# Altium schematic sheet Adquisición_SeñalEMG1.SchDoc
size A4; SheetNumber: 1; SheetTotal: 1; SPICEModelCacheWQRGLCHU: <root> / <DocumentId>WQRGLCHU</DocumentId> / <CacheFrame Number="0"> / <Model Name="mcp601" Kind="CKT"> / <Text>.SUBCKT MCP601 1 2 3 4 5 / *              | | | | | / *              | | | | Output / *              | | | Negative Supply / *              | | Positive Supply / *              | Inverting Input / *              Non-inverting Input / * / ******************************************************************************** / * Software License Agreement                                                   * / *                                                                              * / * The software supplied herewith by Microchip Technology Incorporated (the     * / * 'Company') is intended and supplied to you, the Company's customer, for use  * / * soley and exclusively on Microchip products.                                 * / *                                                                              * / * The software is owned by the Company and/or its supplier, and is protected   * / * under applicable copyright laws. All rights are reserved. Any use in         * / * violation of the foregoing restrictions may subject the user to criminal     * / * sanctions under applicable laws, as well as to civil liability for the       * / * breach of the terms and conditions of this license.                          * / *                                                                              * / * THIS SOFTWARE IS PROVIDED IN AN 'AS IS' CONDITION. NO WARRANTIES, WHETHER    * / * EXPRESS, IMPLIED OR STATUTORY, INCLUDING, BUT NOT LIMITED TO, IMPLIED        * / * WARRANTIES OF MERCHANTABILITY AND FITNESS FOR A PARTICULAR PURPOSE APPLY TO  * / * THIS SOFTWARE. THE COMPANY SHALL NOT, IN ANY CIRCUMSTANCES, BE LIABLE FOR    * / * SPECIAL, INCIDENTAL OR CONSEQUENTIAL DAMAGES, FOR ANY REASON WHATSOEVER.     * / ******************************************************************************** / * / * The following op-amps are covered by this model: / *      MCP601,MCP602,MCP603,MCP604 / * / * Revision History: / *   REV A: 30-Jun-99, BCB (created model) / *   REV B: 10-Jul-99, BCB (corrected DC Iq) / *   REV C: 30-Nov-99, BCB (".subckt" on first line, moved L, W to model) / *   REV D: 17-Jul-02, KEB (improved model) / *   REV E: 27-Aug-06, HNV (added over temperature, improved output stage, / *                         fixed overdrive recovery time) / *                         (MC_RQ, 27-Aug-06, Level 1.17) / * / * Recommendations: / *      Use PSPICE (other simulators may require translation) / *      For a quick, effective design, use a combination of: data sheet / *            specs, bench testing, and simulations with this macromodel / *      For high impedance circuits, set GMIN=100F in the .OPTIONS statement / * / * Supported: / *      Typical performance for temperature range (-40 to 125) degrees Celsius / *      DC, AC, Transient, and Noise analyses. / *      Most specs, including: offsets, DC PSRR, DC CMRR, input impedance, / *            open loop gain, voltage ranges, supply current, ... , etc. / *      Temperature effects for Ibias, Iquiescent, Iout short circuit / *            current, Vsat on both rails, Slew Rate vs. Temp and P.S. / * / * Not Supported: / *      Chip select (MCP603) / *      Some Variation in specs vs. Power Supply Voltage / *      Monte Carlo (Vos, Ib),Process variation / *      Distortion (detailed non-linear behavior) / *      Behavior outside normal operating region / * / * Input Stage / V10  3 10 1.00 / R10 10 11 771K / R11 10 12 771K / G10 10 11 10 11 129U / G11 10 12 10 12 129U / C11 11 12 2P / C12  1  0 6P / E12 71 14 POLY(4) 20 0 21 0 26 0 27 0 1.00M 15 15 1 1 / G12 1 0 62 0 1m / M12 11 14 15 15 NMI / G13 1 2 62 0 .015m / M14 12 2 15 15 NMI / G14 2 0 62 0 1m / C14  2  0 6P / I15 15 4 40.0U / V16 16 4 -300M / GD16 16 1 TABLE {V(16,1)} ((-100,-1p)(0,0)(1m,1u)(2m,10m)) / V13 3 13 1.2 / GD13 2 13 TABLE {V(2,13)} ((-100,-1p)(0,0)(1m,1u)(2m,10m)) / R71  1  0 20.0E12 / R72  2  0 20.0E12 / R73  1  2 20.0E12 / I80  1  2 400F / * / * Noise, PSRR, and CMRR / I20 21 20 423U / D20 20  0 DN1 / D21  0 21 DN1 / G26  0 26 POLY(2) 3 0 4 0   0.00 -50.1U -63.0U / R26 26  0 1 / E271 275 0 1 0 1 / E272 276 0 2 0 1 / R271 275 271 12k / R272 276 272 12k / R273 271 0 1k / R274 272 0 1k / C271 275 271 8.5p / C272 276 272 8.5p / G27  0 27 POLY(2) 271 0 272 0  -555U 100U 100U / R27 27  0 1 / * / * Open Loop Gain, Slew Rate / G30  0 30 12 11 1 / R30 30  0 1.00K / I31 0 31 DC 109.7 / R31 31  0 1 TC=-3.87M,-2.12U / GD31 30 0 TABLE {V(30,31)} ((-100,-1n)(0,0)(1m,0.1)(2m,2)) / I32 32 0 DC 120 / R32 32  0 1 TC=-3.71M,-4.74U / GD32 0 30 TABLE {V(30,32)} ((-2m,2)(-1m,0.1)(0,0)(100,-1n)) / G33  0 33 30 0 1m / R33  33 0 1K / G34  0 34 33 0 334M / R34  34 0 1K / C34  34 0 17.4U / G37  0 37 34 0 1m / R37  37 0 1K / C37  37 0 27P / G38  0 38 37 0 1m / R38  39 0 1K / L38  38 39 44U / E38  35 0 38 0 1 / G35 33 0 TABLE {V(35,3)} ((-1,-1n)(0,0)(5,1n))(6,1)) / G36 33 0 TABLE {V(35,4)} ((-5,-1)((-4,-1n)(0,0)(1,1n)) / * / * Output Stage / R80 50 0 100MEG / G50 0 50 57 96 2 / R58 57  96 0.50 / R57 57  0 500 / C58  5  0 2.00P / G57  0 57 POLY(3) 3 0 4 0 35 0   0 0.2M 0.22M 2.00M / GD55 55 57 TABLE {V(55,57)} ((-2m,-1)(-1m,-1m)(0,0)(10,1n)) / GD56 57 56 TABLE {V(57,56)} ((-2m,-1)(-1m,-1m)(0,0)(10,1n)) / E55 55  0 POLY(2) 3 0 51 0 -2.4M 1 -58.8M / E56 56  0 POLY(2) 4 0 52 0 1.7M 1 -32.3M / R51 51 0 1k / R52 52 0 1k / GD51 50 51 TABLE {V(50,51)} ((-10,-1n)(0,0)(1m,1m)(2m,1)) / GD52 50 52 TABLE {V(50,52)}  ((-2m,-1)(-1m,-1m)(0,0)(10,1n)) / G53  3  0 POLY(1) 51 0  -40.0U 1M / G54  0  4 POLY(1) 52 0  -40.0U -1M / * / * Current Limit / G99 96 5 99 0 1 / R98 0 98 1 TC=-4.33M,9.53U / G97 0 98 TABLE { V(96,5) } ((-11.0,-15.0M)(-1.00M,-14.8M)(0,0)(1.00M,14.8M)(11.0,15.0M)) / E97 99 0 VALUE { V(98)*((V(3)-V(4))*233M + 183M)} / D98 4 5 DESD / D99 5 3 DESD / * / * Temperature / Voltage Sensitive IQuiscent / R61 0 61 1 TC=-3.20M,-8.90U / G61 3 4 61 0 1 / G60 0 61 TABLE {V(3, 4)} / + ((0,0)(900M,0.1U)(1.1,10.0U)(1.3,40.0U) / + (1.6,60.0U)(2.5,200U)(5.5,220U)) / * / * Temperature Sensistive offset voltage / I73 0 70 DC 1uA / R74 0 70 1 TC=2.5 / E75 1 71 70 0 1 / * / * Temp Sensistive IBias / I62 0 62 DC 1uA / R62 0 62 REXP 99U / * / * Models / .MODEL NMI NMOS(L=2.00U W=42.0U KP=20.0U LEVEL=1 ) / .MODEL DESD  D   N=1 IS=1.00E-15 / .MODEL DN1 D   IS=1P KF=0.35F AF=1 / .MODEL REXP RES TCE= 9.1 / .ENDS MCP601</Text> / </Model> / </CacheFrame> / </root>
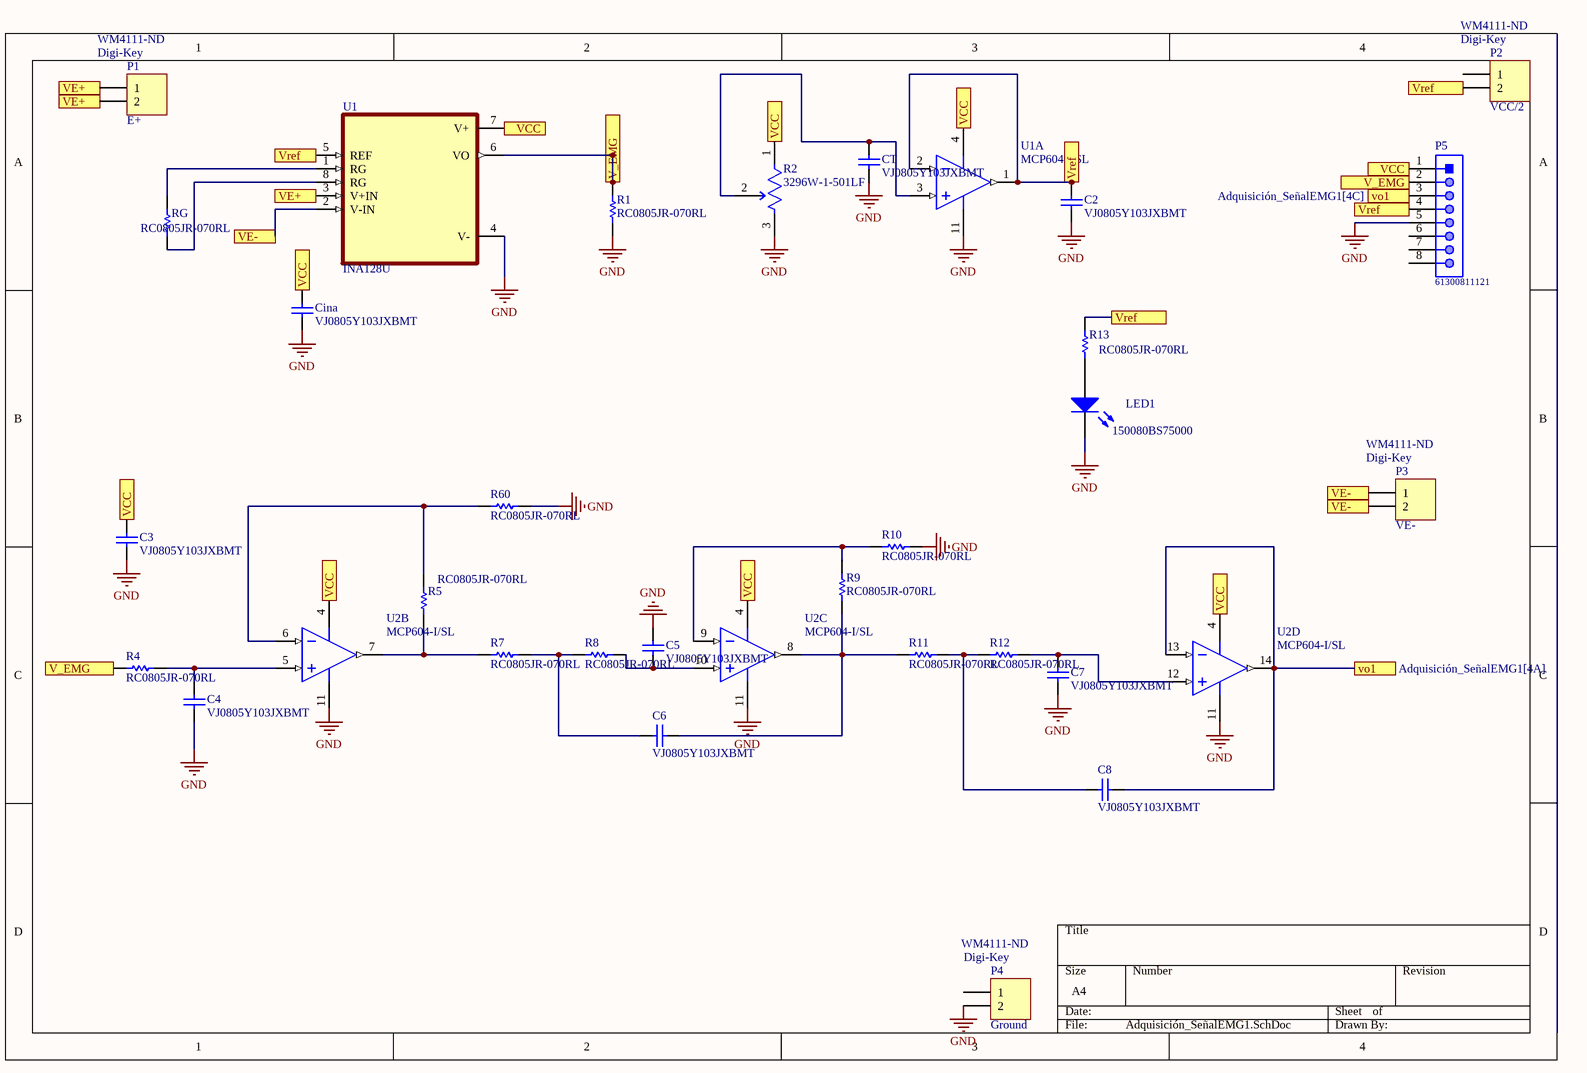
[diagram p0: Adquisición_SeñalEMG1.SchDoc]

## Parts
(Parts that share a designator on the sheet are numbered #1, #2 ... from top to bottom, then left to right.)
C2  VJ0805Y103JXBMT  [CAPC2013X145X48LL20T23]
C3  VJ0805Y103JXBMT  [CAPC2013X145X48LL20T23]
C4  VJ0805Y103JXBMT  [CAPC2013X145X48LL20T23]
C5  VJ0805Y103JXBMT  [CAPC2013X145X48LL20T23]
C6  VJ0805Y103JXBMT  [CAPC2013X145X48LL20T23]
C7  VJ0805Y103JXBMT  [CAPC2013X145X48LL20T23]
C8  VJ0805Y103JXBMT  [CAPC2013X145X48LL20T23]
Cina  VJ0805Y103JXBMT  [CAPC2013X145X48LL20T23]
CT  VJ0805Y103JXBMT  [CAPC2013X145X48LL20T23]
LED1  150080BS75000  [0805_A]
P1  E+  Supplier 1: Digi-Key  Supplier Part Number 1: WM4111-ND  [HDR1X2]
P2  VCC/2  Supplier 1: Digi-Key  Supplier Part Number 1: WM4111-ND  [HDR1X2]
P3  VE-  Supplier 1: Digi-Key  Supplier Part Number 1: WM4111-ND  [HDR1X2]
P4  Ground  Supplier 1: Digi-Key  Supplier Part Number 1: WM4111-ND  [HDR1X2]
P5  61300811121  [61300811121]
R1  RC0805JR-070RL  [RESC2013X60X35ML10T20]
R2  3296W-1-501LF  [FP-3296W-MFG]
R4  RC0805JR-070RL  [RESC2013X60X35ML10T20]
R5  RC0805JR-070RL  [RESC2013X60X35ML10T20]
R7  RC0805JR-070RL  [RESC2013X60X35ML10T20]
R8  RC0805JR-070RL  [RESC2013X60X35ML10T20]
R9  RC0805JR-070RL  [RESC2013X60X35ML10T20]
R10  RC0805JR-070RL  [RESC2013X60X35ML10T20]
R11  RC0805JR-070RL  [RESC2013X60X35ML10T20]
R12  RC0805JR-070RL  [RESC2013X60X35ML10T20]
R13  RC0805JR-070RL  [RESC2013X60X35ML10T20]
R60  RC0805JR-070RL  [RESC2013X60X35ML10T20]
RG  RC0805JR-070RL  [RESC2013X60X35ML10T20]
U1#1  MCP604-I/SL  [SOIC-SL14_M]  (part A of 4)
U1#2  INA128U  [SOIC127P599X175-8N]
U2  MCP604-I/SL  [SOIC-SL14_M]  (parts B,C,D of 4)

## Ports
V_EMG (see Adquisición_SeñalEMG1[1C], Adquisición_SeñalEMG1[2A]), V_EMG (see Adquisición_SeñalEMG1[1C], Adquisición_SeñalEMG1[4A]), V_EMG (see Adquisición_SeñalEMG1[2A], Adquisición_SeñalEMG1[4A]), VCC (see Adquisición_SeñalEMG1[1B], Adquisición_SeñalEMG1[1C], Adquisición_SeñalEMG1[2A], Adquisición_SeñalEMG1[2C], Adquisición_SeñalEMG1[3A], Adquisición_SeñalEMG1[4A]), VCC (see Adquisición_SeñalEMG1[1B], Adquisición_SeñalEMG1[1C], Adquisición_SeñalEMG1[2A], Adquisición_SeñalEMG1[2C], Adquisición_SeñalEMG1[3A], Adquisición_SeñalEMG1[4A], Adquisición_SeñalEMG1[4C]), VCC (see Adquisición_SeñalEMG1[1B], Adquisición_SeñalEMG1[1C], Adquisición_SeñalEMG1[2A], Adquisición_SeñalEMG1[2C], Adquisición_SeñalEMG1[3A], Adquisición_SeñalEMG1[4C]), VCC (see Adquisición_SeñalEMG1[1B], Adquisición_SeñalEMG1[1C], Adquisición_SeñalEMG1[2A], Adquisición_SeñalEMG1[2C], Adquisición_SeñalEMG1[4A], Adquisición_SeñalEMG1[4C]), VCC (see Adquisición_SeñalEMG1[1B], Adquisición_SeñalEMG1[1C], Adquisición_SeñalEMG1[2A], Adquisición_SeñalEMG1[3A], Adquisición_SeñalEMG1[4A], Adquisición_SeñalEMG1[4C]), VCC (see Adquisición_SeñalEMG1[1B], Adquisición_SeñalEMG1[2A], Adquisición_SeñalEMG1[2C], Adquisición_SeñalEMG1[3A], Adquisición_SeñalEMG1[4A], Adquisición_SeñalEMG1[4C]), VE+ (see Adquisición_SeñalEMG1[1A]), VE- (see Adquisición_SeñalEMG1[1A], Adquisición_SeñalEMG1[4B]), VE- (see Adquisición_SeñalEMG1[4B]), vo1 (see Adquisición_SeñalEMG1[4A]), vo1 (see Adquisición_SeñalEMG1[4C]), Vref (see Adquisición_SeñalEMG1[1A], Adquisición_SeñalEMG1[3A], Adquisición_SeñalEMG1[3B], Adquisición_SeñalEMG1[4A]), Vref (see Adquisición_SeñalEMG1[1A], Adquisición_SeñalEMG1[3A], Adquisición_SeñalEMG1[4A]), Vref (see Adquisición_SeñalEMG1[1A], Adquisición_SeñalEMG1[3B], Adquisición_SeñalEMG1[4A]), Vref (see Adquisición_SeñalEMG1[3A], Adquisición_SeñalEMG1[3B], Adquisición_SeñalEMG1[4A])

## Nets
GND: C2.1 C3.1 C4.1 C5.1 C7.2 Cina.1 CT.1 LED1.1(K) P4.2 P5.5 R1.1 R2.3(CW) R10.2 R60.1 U1#1.11(VSS) U1#2.4(V-) U2.11(VSS)
V_EMG: P5.2 R1.2 R4.1 U1#2.6(VO) ; port V_EMG
VCC: C3.2 Cina.2 P5.1 R2.1(CCW) U1#1.4(VDD) U1#2.7(V+) U2.4(VDD) ; port VCC
VE+: P1.1 P1.2 U1#2.3(V+IN) ; port VE+
VE-: P3.1 P3.2 U1#2.2(V-IN) ; port VE-
vo1: C8.2 P5.3 U2.13(VIND-) U2.14(VOUTD) ; port vo1
Vref: C2.2 P2.2 P5.4 R13.2 U1#1.1(VOUTA) U1#1.2(VINA-) U1#2.5(REF) ; port Vref
NetC4_2: C4.2 R4.2 U2.5(VINB+)
NetC5_2: C5.2 R8.2 U2.10(VINC+)
NetC6_1: C6.1 R9.1 R11.1 U2.8(VOUTC)
NetC6_2: C6.2 R7.2 R8.1
NetC7_1: C7.1 R12.2 U2.12(VIND+)
NetC8_1: C8.1 R11.2 R12.1
NetCT_2: CT.2 R2.2(WIPER) U1#1.3(VINA+)
NetLED1_2: LED1.2(A) R13.1
NetR5_1: R5.1 R7.1 U2.7(VOUTB)
NetR5_2: R5.2 R60.2 U2.6(VINB-)
NetR9_2: R9.2 R10.1 U2.9(VINC-)
NetRG_1: RG.1 U1#2.8(RG)
NetRG_2: RG.2 U1#2.1(RG)

Not connected (* = marked no-connect by the designer): P2 1; P4 1; P5 6 7 8

## Library data of the parts
C2-C8 Cina CT = CMP-2007-01883-1: Manufacturer: Vitramon; Part Number: VJ0805Y103JXBMT
LED1 = CMP-1426-00008-1: SMD mono-color Chip LED, WL-SMCW, Blue; Manufacturer: Wuerth Elektronik; Color: Blue; ComponentLink2URL: http://katalog.we-online.com/led/datasheet/150080BS75000.pdf; ComponentLink1URL: http://www.we-online.com; ComponentLink2Description: Datasheet; PackageReference: 0805_A; ComponentLink1Description: Manufacturer URL; PartNumber: 150080BS75000
P1-P4 = Header 2: Header, 2-Pin; LatestRevisionDate: 17-Jul-2002; LatestRevisionNote: Re-released for DXP Platform.; Publisher: Altium Limited
P5 = CMP-1502-01076-1: THT Vertical Pin Header WR-PHD, Pitch 2.54 mm, Single Row, 8 pins; Manufacturer: Wurth Elektronik; Rated Current: 3A; Pin Number: 8; Working Voltage: 250VAC; Gender: Male; Contact Resistance: 20mOhm; Pitch: 2.54mm; Withstanding Voltage: 500VAC; Publisher: WurthElektronik; Operating Temperature: -40to105degC; Orientation: Vertical; Row Number: Single; Part Number: 61300811121; Package Reference: 61300811121; Mounting Technology: THT; Packaging: Bag; Manufacturer URL: http://www.we-online.de; Datasheet URL: https://katalog.we-online.de/em/datasheet/6130xx11121.pdf
R1 R4 R5 R7-R13 R60 RG = CMP-2100-03673-1: Chip Resistor, 0 Ohm, Jumper, +/- 5%, 0.125 W, -55 to 155 degC, 0805 (2012 Metric), RoHS, Tape and Reel; Manufacturer: Yageo; Power Rating: 125mW; Resistance: 0mOhm; Voltage Rating (DC): 150V; Temperature Coefficient: 200ppm/degreesC; Height: 0.5mm; Depth: 1.25mm; Case Code (Imperial): 0805; Lead Free: LeadFree; Military Standard: Not; Package Description: 2-Pin Surface Mounted Device, Body 2 x 1.25 mm; Case Code (Metric): 2012; Composition: ThickFilm; Voltage Rating: 150V; Manufacturer URL: http://www.yageo.com/; Packaging: TapeandReel; Package Reference: 0805; REACH SVHC: Unknown; Tolerance: 5%; Case/Package: 0805; Max Operating Temperature: 155degC; Number of Pins: 2; Min Operating Temperature: -55degC; RoHSCompliant: true; Length: 2mm; Datasheet URL: http://www.yageo.com/NewPortal/yageodocoutput?fileName=/pdf/R-Chip/PYu-RC_Group_51_RoHS_L_5.pdf; Termination: SMD/SMT; Radiation Hardening: No; Width: 1.25mm; Contact Plating: Tin; Datasheet Version: Rev. 5, 10/2016
R2 = CMP-07234-000046-1: TRIMMER 500 OHM 0.5W PC PIN TOP; Resistance: 500R; Temperature Coefficient: 100ppm/°C; Resistance Tolerance: 10%; Number of Turns: 25; Max Power Dissipation: 500mW; Packaging: Rail/Tube; Color: Blue; Technology: CERMET; Max Operating Temperature: 125°C; RoHS Compliant: Yes; Radiation Hardening: No; Series: 3296; Military Standard: Not; Width: 9.53mm; Weight: 0.03oz; Length: 9.53mm; Package Quantity: 50; Height: 0.395inch; Min Operating Temperature: -55°C; Lead Free: Lead Free; Mount: Through Hole; Depth: 4.83mm; Termination: Pin; Taper: Linear; Contact Plating: Tin; Resistor Type: Cermet; Tolerance: 10%; REACH SVHC: No SVHC; Power Rating: 500mW
U1#1 U2 = CMP-0187-00360-3: None; Supply Current: 230uA; Operating Supply Voltage: 5.5V; Number of Amplifiers: 4; Input Bias Current: 60pA; Output Current: 22mA; Unity Gain Bandwidth Product: 2.8MHz; Min Supply Voltage: 2.7V; Common Mode Rejection Ratio: 75dB; Slew Rate: 2.3V/µs; Input Offset Voltage-Max: 2mV; Amplifier Type: GENERAL PURPOSE; Max Supply Voltage: 6V; Power Supply Rejection Ratio (PSRR): 80dB; Voltage Gain: 115dB; Height: 1.25mm; Mount: Surface Mount; REACH SVHC: No SVHC; Min Operating Temperature: -40°C; Number of Pins: 14; Max Operating Temperature: 85°C; Radiation Hardening: No; Lead Free: Lead Free; Bandwidth: 2.8MHz; Number of Elements: 4; Case/Package: SOIC; Nominal Supply Current: 230uA; Number of Circuits: 4; Slew Rate-Nom: 2.3V/µs; Length: 8.65mm; RoHS Compliant: Yes; Input Offset Voltage (Vos): 2mV; Width: 3.9mm; Gain Bandwidth Product: 2.8MHz; Package Quantity: 57; Technology: CMOS; Number of Channels: 4; Packaging: Rail/Tube
U1#2 = INA128U: Precision, 130-dB CMRR, 700-A, Low-Power, Instrumentation Amplifier 8-SOIC; MF: Texas; Package: SOIC-8 Burr Brown; Check_prices: https://www.snapeda.com/parts/INA128U/Texas%20Instruments/view-part/631537/?ref=eda; SnapEDA_Link: https://www.snapeda.com/parts/INA128U/Texas%20Instruments/view-part/631537/?ref=snap; MP: INA128U; Value: *; Purchase-URL: https://pricing.snapeda.com/search/part/INA128U/?ref=eda; Availability: Good; Price: None